# EAGLE schematic hackeeg-shield (EAGLE 9.5.2)

## Sheet 1 of 3: ADS1299 and power supplies
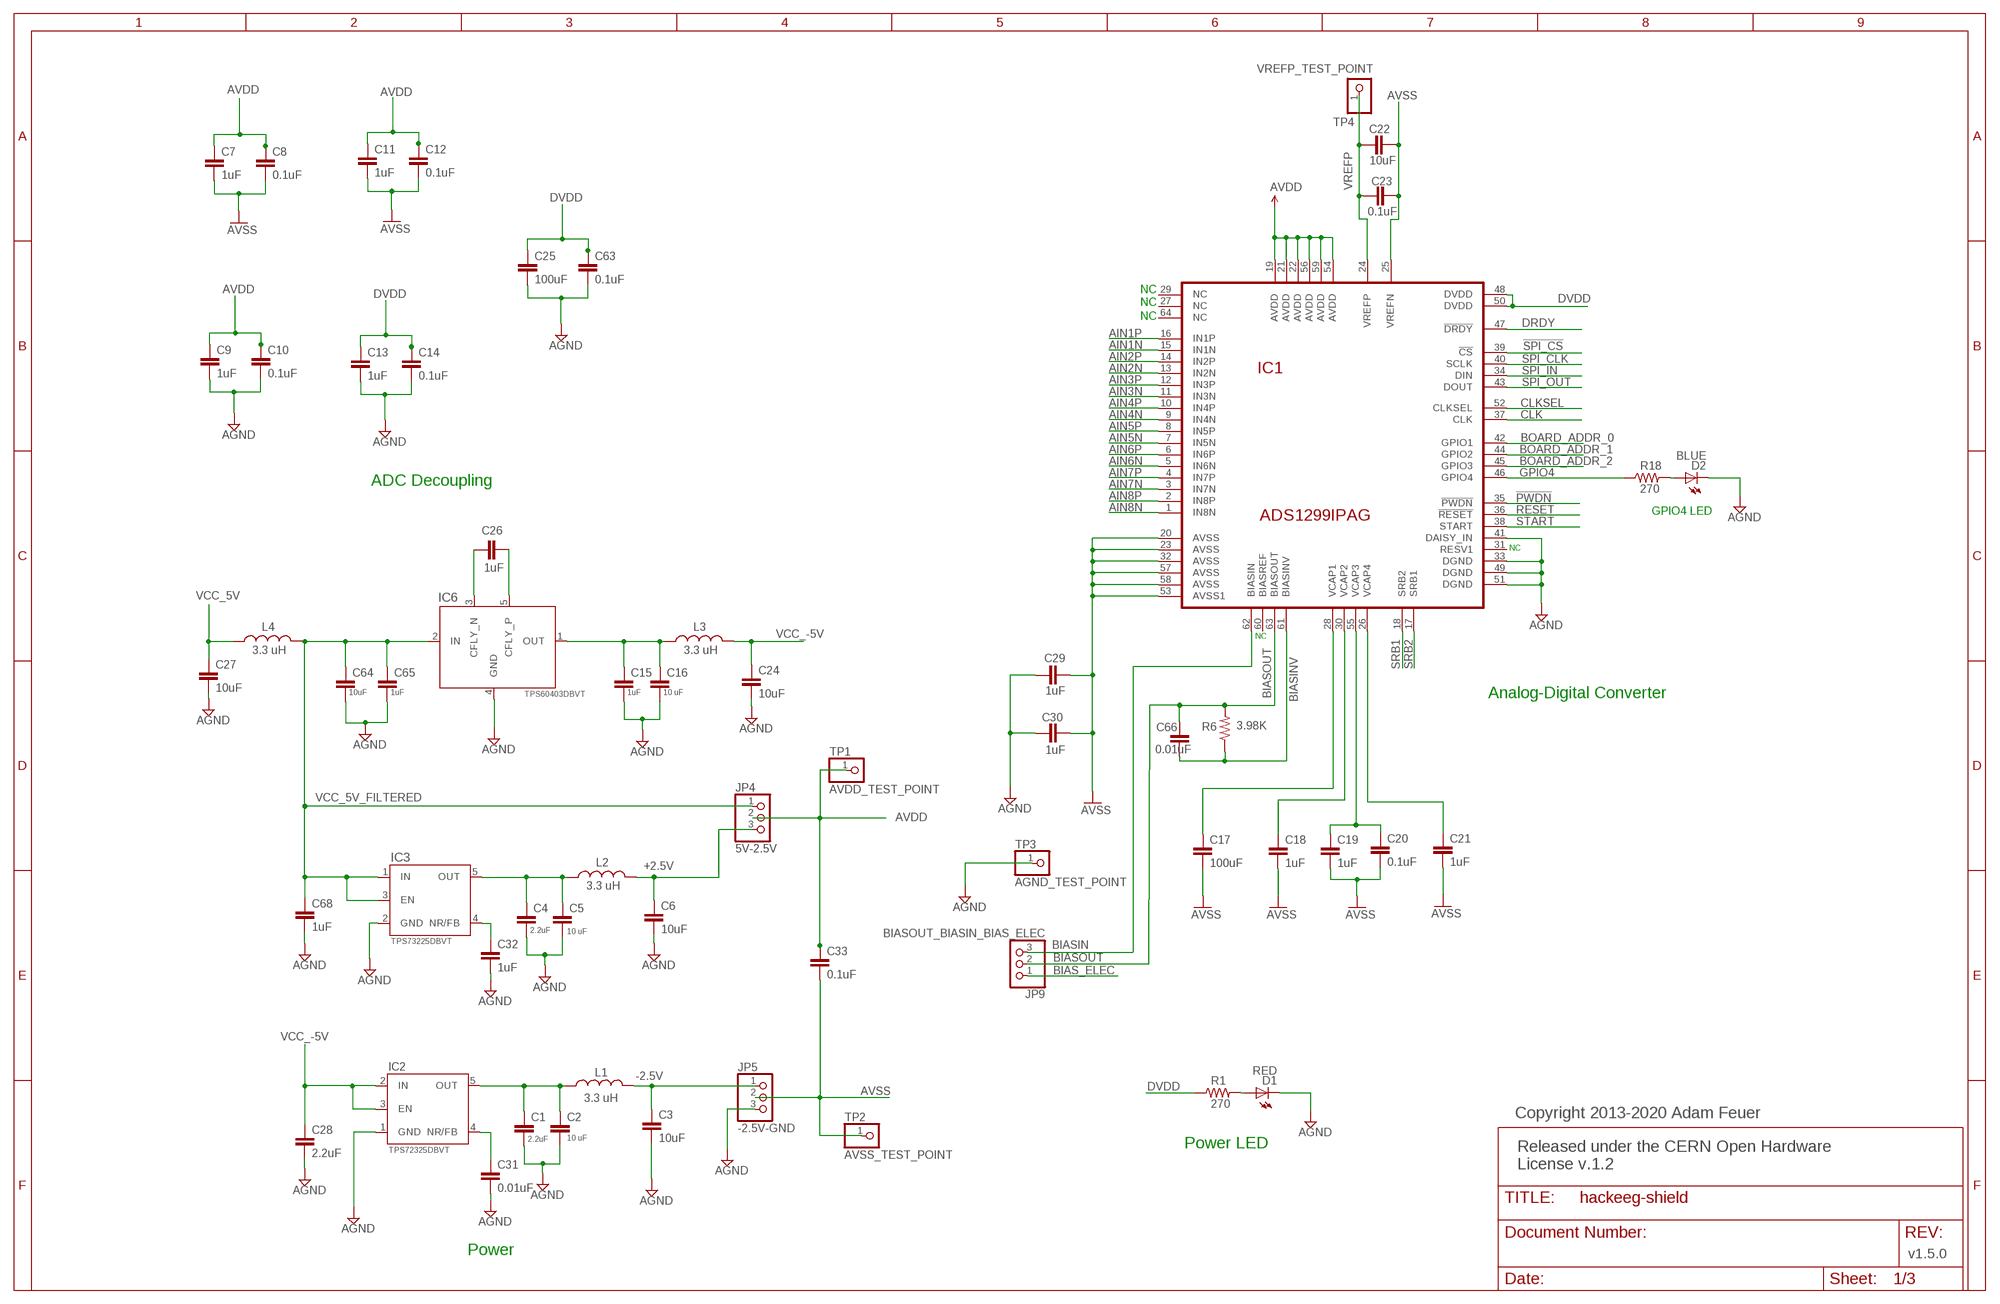
[diagram p0: schematic, sheet 1]

### Parts
C1  2.2uF  CAP0603-CAP  [0603-CAP]
C2  10 uF  CAP0603-CAP  [0603-CAP]
C3  10uF  CAP0603-CAP  [0603-CAP]
C4  2.2uF  CAP0603-CAP  [0603-CAP]
C5  10 uF  CAP0603-CAP  [0603-CAP]
C6  10uF  CAP0603-CAP  [0603-CAP]
C7  1uF  CAP0603-CAP  [0603-CAP]
C8  0.1uF  CAP0603-CAP  [0603-CAP]
C9  1uF  CAP0603-CAP  [0603-CAP]
C10  0.1uF  CAP0603-CAP  [0603-CAP]
C11  1uF  CAP0603-CAP  [0603-CAP]
C12  0.1uF  CAP0603-CAP  [0603-CAP]
C13  1uF  CAP0603-CAP  [0603-CAP]
C14  0.1uF  CAP0603-CAP  [0603-CAP]
C15  1uF  CAP0603-CAP  [0603-CAP]
C16  10 uF  CAP0603-CAP  [0603-CAP]
C17  100uF  CAP1210  [1210]
C18  1uF  CAP0603-CAP  [0603-CAP]
C19  1uF  CAP0603-CAP  [0603-CAP]
C20  0.1uF  CAP0603-CAP  [0603-CAP]
C21  1uF  CAP0603-CAP  [0603-CAP]
C22  10uF  CAP0603-CAP  [0603-CAP]
C23  0.1uF  CAP0603-CAP  [0603-CAP]
C24  10uF  CAP0603-CAP  [0603-CAP]
C25  100uF  CAP1210  [1210]
C26  1uF  CAP0603-CAP  [0603-CAP]
C27  10uF  CAP0603-CAP  [0603-CAP]
C28  2.2uF  CAP0603-CAP  [0603-CAP]
C29  1uF  CAP0603-CAP  [0603-CAP]
C30  1uF  CAP0603-CAP  [0603-CAP]
C31  0.01uF  CAP0603-CAP  [0603-CAP]
C32  1uF  CAP0603-CAP  [0603-CAP]
C33  0.1uF  CAP0603-CAP  [0603-CAP]
C63  0.1uF  CAP0603-CAP  [0603-CAP]
C64  10uF  CAP0603-CAP  [0603-CAP]
C65  1uF  CAP0603-CAP  [0603-CAP]
C66  0.01uF  CAP0603-CAP  [0603-CAP]
C68  1uF  CAP0603-CAP  [0603-CAP]
D1  RED  LED-RED1206  [LED-1206]
D2  BLUE  LED-WHITE  [LED-1206]
IC1  ADS1299IPAG  ADS1299*PAG*  [TQFP64]
IC2  TPS72325DBVT  TPS732XXDBV  [SOT23-5]
IC3  TPS73225DBVT  TPS732XXDBV  [SOT23-5]
IC6  TPS60403DBVT  TPS604XXDBV  [SOT23-5]
JP4  5V-2.5V  PINHD-1X3  [1X03]
JP5  -2.5V-GND  PINHD-1X3  [1X03]
JP9  BIASOUT_BIASIN_BIAS_ELEC  PINHD-1X3  [1X03]
L1  3.3 uH  INDUCTOR0805  [0805]
L2  3.3 uH  INDUCTOR0805  [0805]
L3  3.3 uH  INDUCTOR0805  [0805]
L4  3.3 uH  INDUCTOR0805  [0805]
R1  270  RESISTOR0603-RES  [0603-RES]
R6  3.98K  RESISTOR0603-RES  [0603-RES]
R18  270  RESISTOR0603-RES  [0603-RES]
TP1  AVDD_TEST_POINT  PINHD-1X1  [1X01]
TP2  AVSS_TEST_POINT  PINHD-1X1  [1X01]
TP3  AGND_TEST_POINT  PINHD-1X1  [1X01]
TP4  VREFP_TEST_POINT  PINHD-1X1  [1X01]

### Nets
!PWDN: IC1.35(!PWDN) ; also sheet 3
!RESET: IC1.36(!RESET) ; also sheet 3
!SPI_CS: IC1.39(!CS) ; also sheet 3
+2.5V: C6.1 JP4.3 L2.2
-2.5V: C3.1 JP5.1 L1.2
AGND: C1.2 C2.2 C3.2 C4.2 C5.2 C6.2 C9.2 C10.2 C13.2 C14.2 C15.2 C16.2 C24.2 C25.2 C27.2 C28.2 C29.1 C30.1 C31.2 C32.2 C63.2 C64.2 C65.2 C68.2 D1.C D2.C IC1.33(DGND) IC1.41(DAISY_IN) IC1.49(DGND) IC1.51(DGND) IC2.1(GND) IC3.2(GND) IC6.4(GND) JP5.3 TP3.1 ; also sheet 2,3
AIN1N: IC1.15(IN1N) ; also sheet 2
AIN1P: IC1.16(IN1P) ; also sheet 2
AIN2N: IC1.13(IN2N) ; also sheet 2
AIN2P: IC1.14(IN2P) ; also sheet 2
AIN3N: IC1.11(IN3N) ; also sheet 2
AIN3P: IC1.12(IN3P) ; also sheet 2
AIN4N: IC1.9(IN4N) ; also sheet 2
AIN4P: IC1.10(IN4P) ; also sheet 2
AIN5N: IC1.7(IN5N) ; also sheet 2
AIN5P: IC1.8(IN5P) ; also sheet 2
AIN6N: IC1.5(IN6N) ; also sheet 2
AIN6P: IC1.6(IN6P) ; also sheet 2
AIN7N: IC1.3(IN7N) ; also sheet 2
AIN7P: IC1.4(IN7P) ; also sheet 2
AIN8N: IC1.1(IN8N) ; also sheet 2
AIN8P: IC1.2(IN8P) ; also sheet 2
AVDD: C7.1 C8.1 C9.1 C10.1 C11.1 C12.1 C33.1 IC1.19(AVDD) IC1.21(AVDD) IC1.22(AVDD) IC1.54(AVDD) IC1.56(AVDD) IC1.59(AVDD) JP4.2 TP1.1 ; also sheet 2
AVSS: C7.2 C8.2 C11.2 C12.2 C17.2 C18.2 C19.2 C20.2 C21.2 C22.2 C23.2 C29.2 C30.2 C33.2 IC1.20(AVSS) IC1.23(AVSS) IC1.25(VREFN) IC1.32(AVSS) IC1.53(AVSS1) IC1.57(AVSS) IC1.58(AVSS) JP5.2 TP2.1 ; also sheet 2
BIAS_ELEC: JP9.1 ; also sheet 2
BIASIN: IC1.62(BIASIN) JP9.3
BIASINV: C66.2 IC1.61(BIASINV) R6.1 ; also sheet 2,3
BIASOUT: C66.1 IC1.63(BIASOUT) JP9.2 R6.2
BOARD_ADDR_0: IC1.42(GPIO1) ; also sheet 3
BOARD_ADDR_1: IC1.44(GPIO2) ; also sheet 3
BOARD_ADDR_2: IC1.45(GPIO3) ; also sheet 3
CLK: IC1.37(CLK) ; also sheet 3
CLKSEL: IC1.52(CLKSEL) ; also sheet 3
DRDY: IC1.47(!DRDY) ; also sheet 3
DVDD: C13.1 C14.1 C25.1 C63.1 IC1.48(DVDD) IC1.50(DVDD) R1.1 ; also sheet 2,3
GPIO4: IC1.46(GPIO4) R18.1
N$1: C4.1 C5.1 IC3.5(OUT) L2.1
N$2: C1.1 C2.1 IC2.5(OUT) L1.1
N$3: C17.1 IC1.28(VCAP1)
N$4: C18.1 IC1.30(VCAP2)
N$5: C19.1 C20.1 IC1.55(VCAP3)
N$7: C15.1 C16.1 IC6.1(OUT) L3.1
N$8: C21.1 IC1.26(VCAP4)
N$9: C26.2 IC6.5(CFLY_P)
N$10: C26.1 IC6.3(CFLY_N)
N$11: C32.1 IC3.4(NR/FB)
N$13: C31.1 IC2.4(NR/FB)
N$14: D2.A R18.2
N$19: D1.A R1.2
SPI_CLK: IC1.40(SCLK) ; also sheet 3
SPI_IN: IC1.34(DIN) ; also sheet 3
SPI_OUT: IC1.43(DOUT) ; also sheet 3
SRB1: IC1.18(SRB2) ; also sheet 2
SRB2: IC1.17(SRB1) ; also sheet 2
START: IC1.38(START) ; also sheet 3
VCC_5V: C27.1 L4.1 ; also sheet 3
VCC_5V_FILTERED: C64.1 C65.1 C68.1 IC3.1(IN) IC3.3(EN) IC6.2(IN) JP4.1 L4.2
VCC_-5V: C24.1 C28.1 IC2.2(IN) IC2.3(EN) L3.2
VREFP: C22.1 C23.1 IC1.24(VREFP) TP4.1
Unconnected: IC1.27(NC) IC1.29(NC) IC1.31(RESV1) IC1.60(BIASREF) IC1.64(NC)

### Notes on the sheet
- NC
- NC
- NC
- ADC Decoupling
- GPIO4 LED
- NC
- NC
- Analog-Digital Converter
- Copyright 2013-2020 Adam Feuer
- Power LED
- Released under the CERN Open Hardware 
  License v.1.2
- Power | v1.5.0

## Sheet 2 of 3: Input filtering and electrode connector
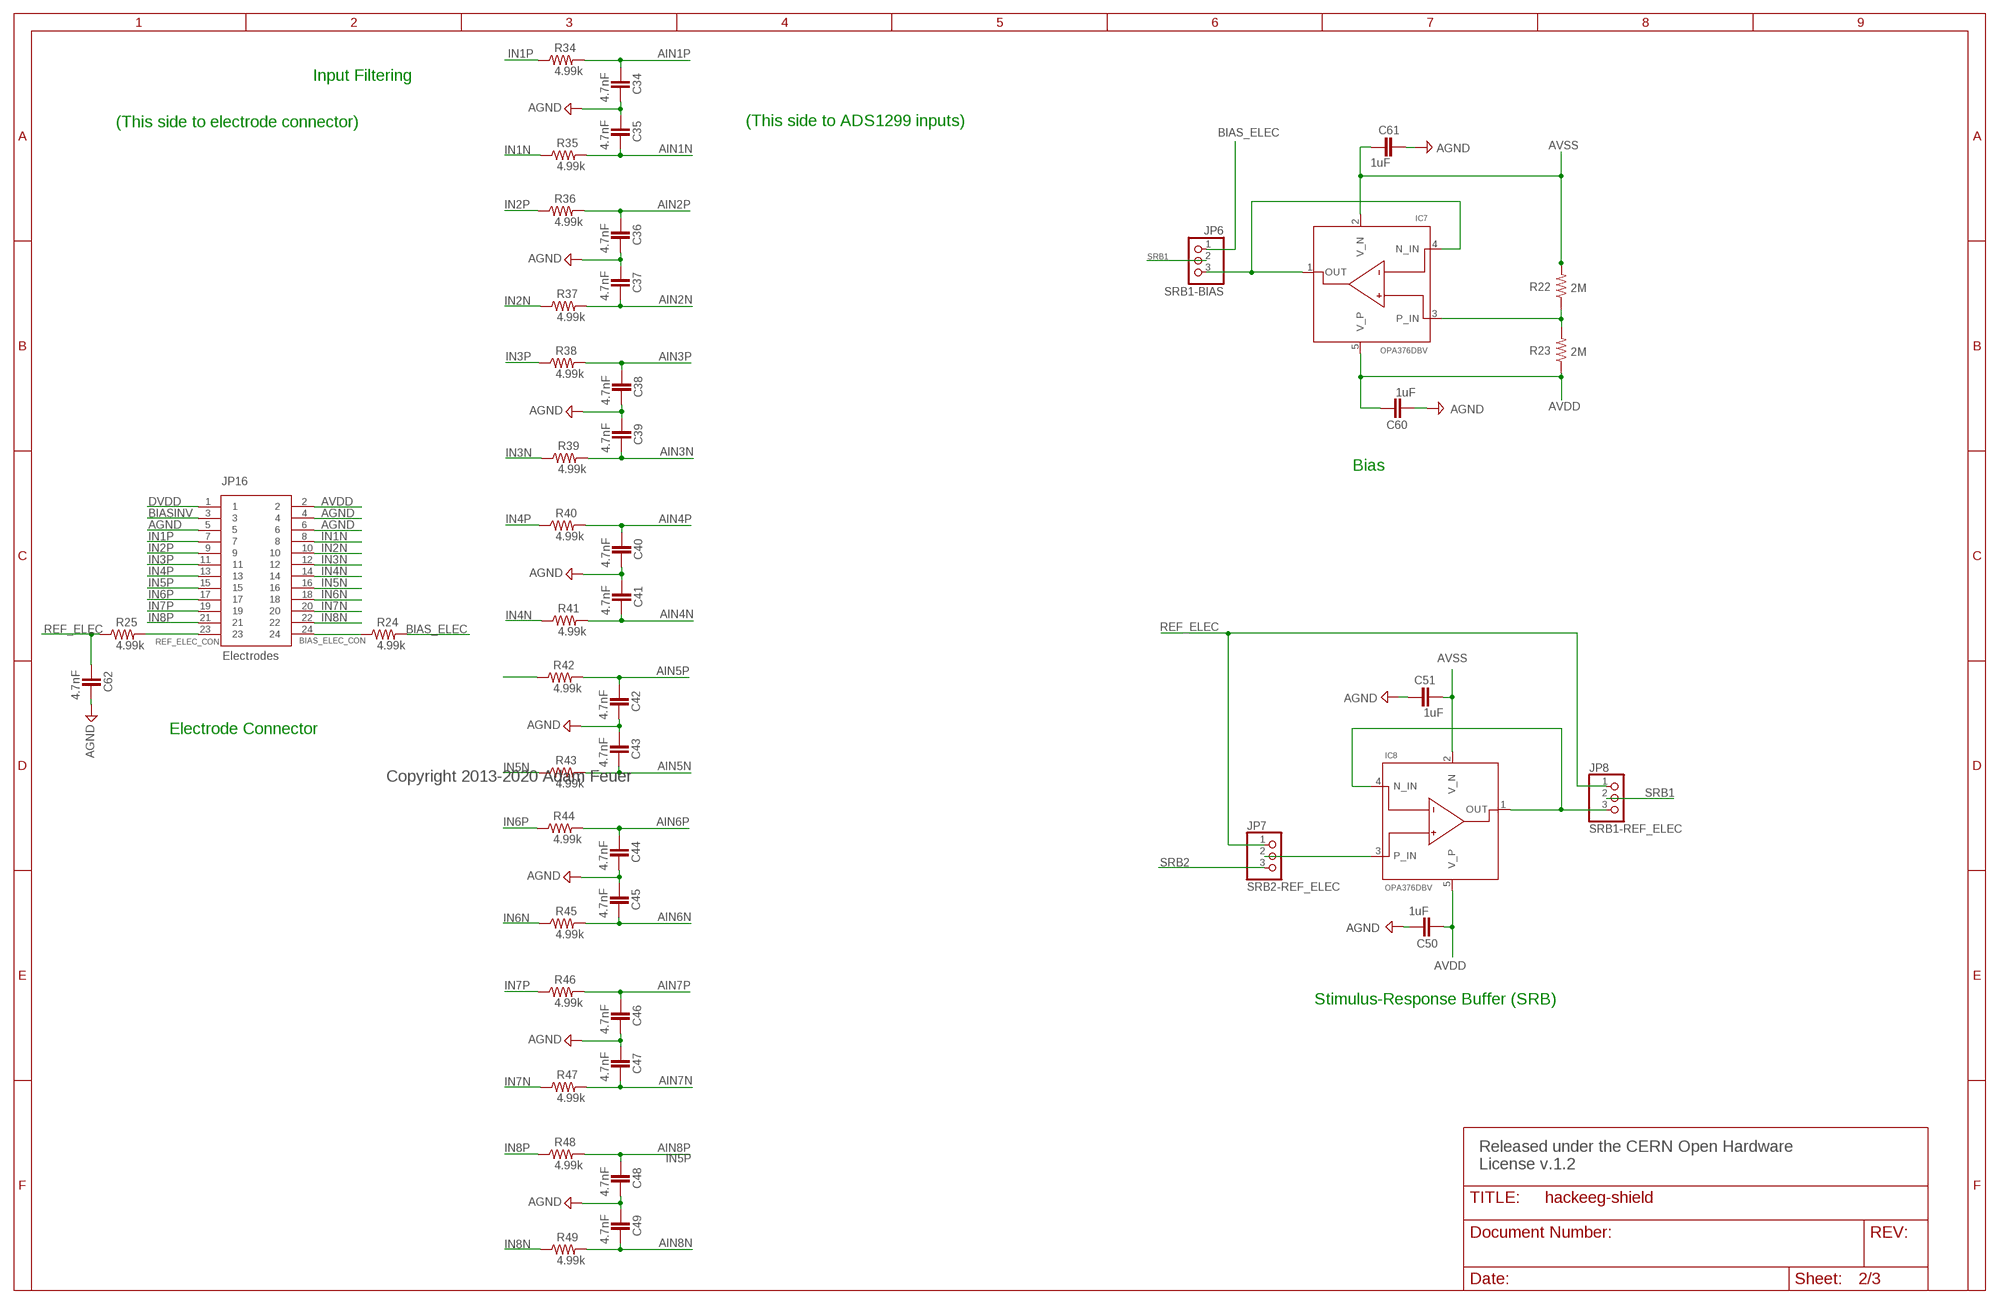
[diagram p1: schematic, sheet 2]

### Parts
C34  4.7nF  CAP0603-CAP  [0603-CAP]
C35  4.7nF  CAP0603-CAP  [0603-CAP]
C36  4.7nF  CAP0603-CAP  [0603-CAP]
C37  4.7nF  CAP0603-CAP  [0603-CAP]
C38  4.7nF  CAP0603-CAP  [0603-CAP]
C39  4.7nF  CAP0603-CAP  [0603-CAP]
C40  4.7nF  CAP0603-CAP  [0603-CAP]
C41  4.7nF  CAP0603-CAP  [0603-CAP]
C42  4.7nF  CAP0603-CAP  [0603-CAP]
C43  4.7nF  CAP0603-CAP  [0603-CAP]
C44  4.7nF  CAP0603-CAP  [0603-CAP]
C45  4.7nF  CAP0603-CAP  [0603-CAP]
C46  4.7nF  CAP0603-CAP  [0603-CAP]
C47  4.7nF  CAP0603-CAP  [0603-CAP]
C48  4.7nF  CAP0603-CAP  [0603-CAP]
C49  4.7nF  CAP0603-CAP  [0603-CAP]
C50  1uF  CAP0603-CAP  [0603-CAP]
C51  1uF  CAP0603-CAP  [0603-CAP]
C60  1uF  CAP0603-CAP  [0603-CAP]
C61  1uF  CAP0603-CAP  [0603-CAP]
C62  4.7nF  CAP0603-CAP  [0603-CAP]
IC7  OPA376DBV  [SOT23-5]
IC8  OPA376DBV  [SOT23-5]
JP6  SRB1-BIAS  PINHD-1X3  [1X03]
JP7  SRB2-REF_ELEC  PINHD-1X3  [1X03]
JP8  SRB1-REF_ELEC  PINHD-1X3  [1X03]
JP16  Electrodes  302-R241  [OST_302-R241]
R22  2M  RESISTOR0603-RES  [0603-RES]
R23  2M  RESISTOR0603-RES  [0603-RES]
R24  4.99k  RESISTOR0603-RES  [0603-RES]
R25  4.99k  RESISTOR0603-RES  [0603-RES]
R34  4.99k  RESISTOR0603-RES  [0603-RES]
R35  4.99k  RESISTOR0603-RES  [0603-RES]
R36  4.99k  RESISTOR0603-RES  [0603-RES]
R37  4.99k  RESISTOR0603-RES  [0603-RES]
R38  4.99k  RESISTOR0603-RES  [0603-RES]
R39  4.99k  RESISTOR0603-RES  [0603-RES]
R40  4.99k  RESISTOR0603-RES  [0603-RES]
R41  4.99k  RESISTOR0603-RES  [0603-RES]
R42  4.99k  RESISTOR0603-RES  [0603-RES]
R43  4.99k  RESISTOR0603-RES  [0603-RES]
R44  4.99k  RESISTOR0603-RES  [0603-RES]
R45  4.99k  RESISTOR0603-RES  [0603-RES]
R46  4.99k  RESISTOR0603-RES  [0603-RES]
R47  4.99k  RESISTOR0603-RES  [0603-RES]
R48  4.99k  RESISTOR0603-RES  [0603-RES]
R49  4.99k  RESISTOR0603-RES  [0603-RES]

### Nets
AGND: C34.2 C35.1 C36.2 C37.1 C38.2 C39.1 C40.2 C41.1 C42.2 C43.1 C44.2 C45.1 C46.2 C47.1 C48.2 C49.1 C50.2 C51.1 C60.2 C61.1 C62.2 JP16.4 JP16.5 JP16.6 ; also sheet 1,3
AIN1N: C35.2 R35.2 ; also sheet 1
AIN1P: C34.1 R34.2 ; also sheet 1
AIN2N: C37.2 R37.2 ; also sheet 1
AIN2P: C36.1 R36.2 ; also sheet 1
AIN3N: C39.2 R39.2 ; also sheet 1
AIN3P: C38.1 R38.2 ; also sheet 1
AIN4N: C41.2 R41.2 ; also sheet 1
AIN4P: C40.1 R40.2 ; also sheet 1
AIN5N: C43.2 R43.2 ; also sheet 1
AIN5P: C42.1 R42.2 ; also sheet 1
AIN6N: C45.2 R45.2 ; also sheet 1
AIN6P: C44.1 R44.2 ; also sheet 1
AIN7N: C47.2 R47.2 ; also sheet 1
AIN7P: C46.1 R46.2 ; also sheet 1
AIN8N: C49.2 R49.2 ; also sheet 1
AIN8P: C48.1 R48.2 ; also sheet 1
AVDD: C50.1 C60.1 IC7.5(V_P) IC8.5(V_P) JP16.2 R23.1 ; also sheet 1
AVSS: C51.2 C61.2 IC7.2(V_N) IC8.2(V_N) R22.2 ; also sheet 1
BIAS_ELEC: JP6.1 R24.2 ; also sheet 1
BIAS_ELEC_CON: JP16.24 R24.1
BIASINV: JP16.3 ; also sheet 1,3
DVDD: JP16.1 ; also sheet 1,3
IN1N: JP16.8 R35.1
IN1P: JP16.7 R34.1
IN2N: JP16.10 R37.1
IN2P: JP16.9 R36.1
IN3N: JP16.12 R39.1
IN3P: JP16.11 R38.1
IN4N: JP16.14 R41.1
IN4P: JP16.13 R40.1
IN5N: JP16.16 R43.1
IN5P: JP16.15 R42.1
IN6N: JP16.18 R45.1
IN6P: JP16.17 R44.1
IN7N: JP16.20 R47.1
IN7P: JP16.19 R46.1
IN8N: JP16.22 R49.1
IN8P: JP16.21 R48.1
N$15: IC7.3(P_IN) R22.1 R23.2
N$16: IC8.3(P_IN) JP7.2
N$17: IC8.1(OUT) IC8.4(N_IN) JP8.3
N$18: IC7.1(OUT) IC7.4(N_IN) JP6.3
REF_ELEC: C62.1 JP7.1 JP8.1 R25.1
REF_ELEC_CON: JP16.23 R25.2
SRB1: JP6.2 JP8.2 ; also sheet 1
SRB2: JP7.3 ; also sheet 1

### Notes on the sheet
- Input Filtering
- (This side to electrode connector) | (This side to ADS1299 inputs)
- Bias
- Electrode Connector
- Copyright 2013-2020 Adam Feuer
- Stimulus-Response Buffer (SRB)
- Released under the CERN Open Hardware 
  License v.1.2

## Sheet 3 of 3: Board to board connectors, configuration, EEPROM, and level shifting
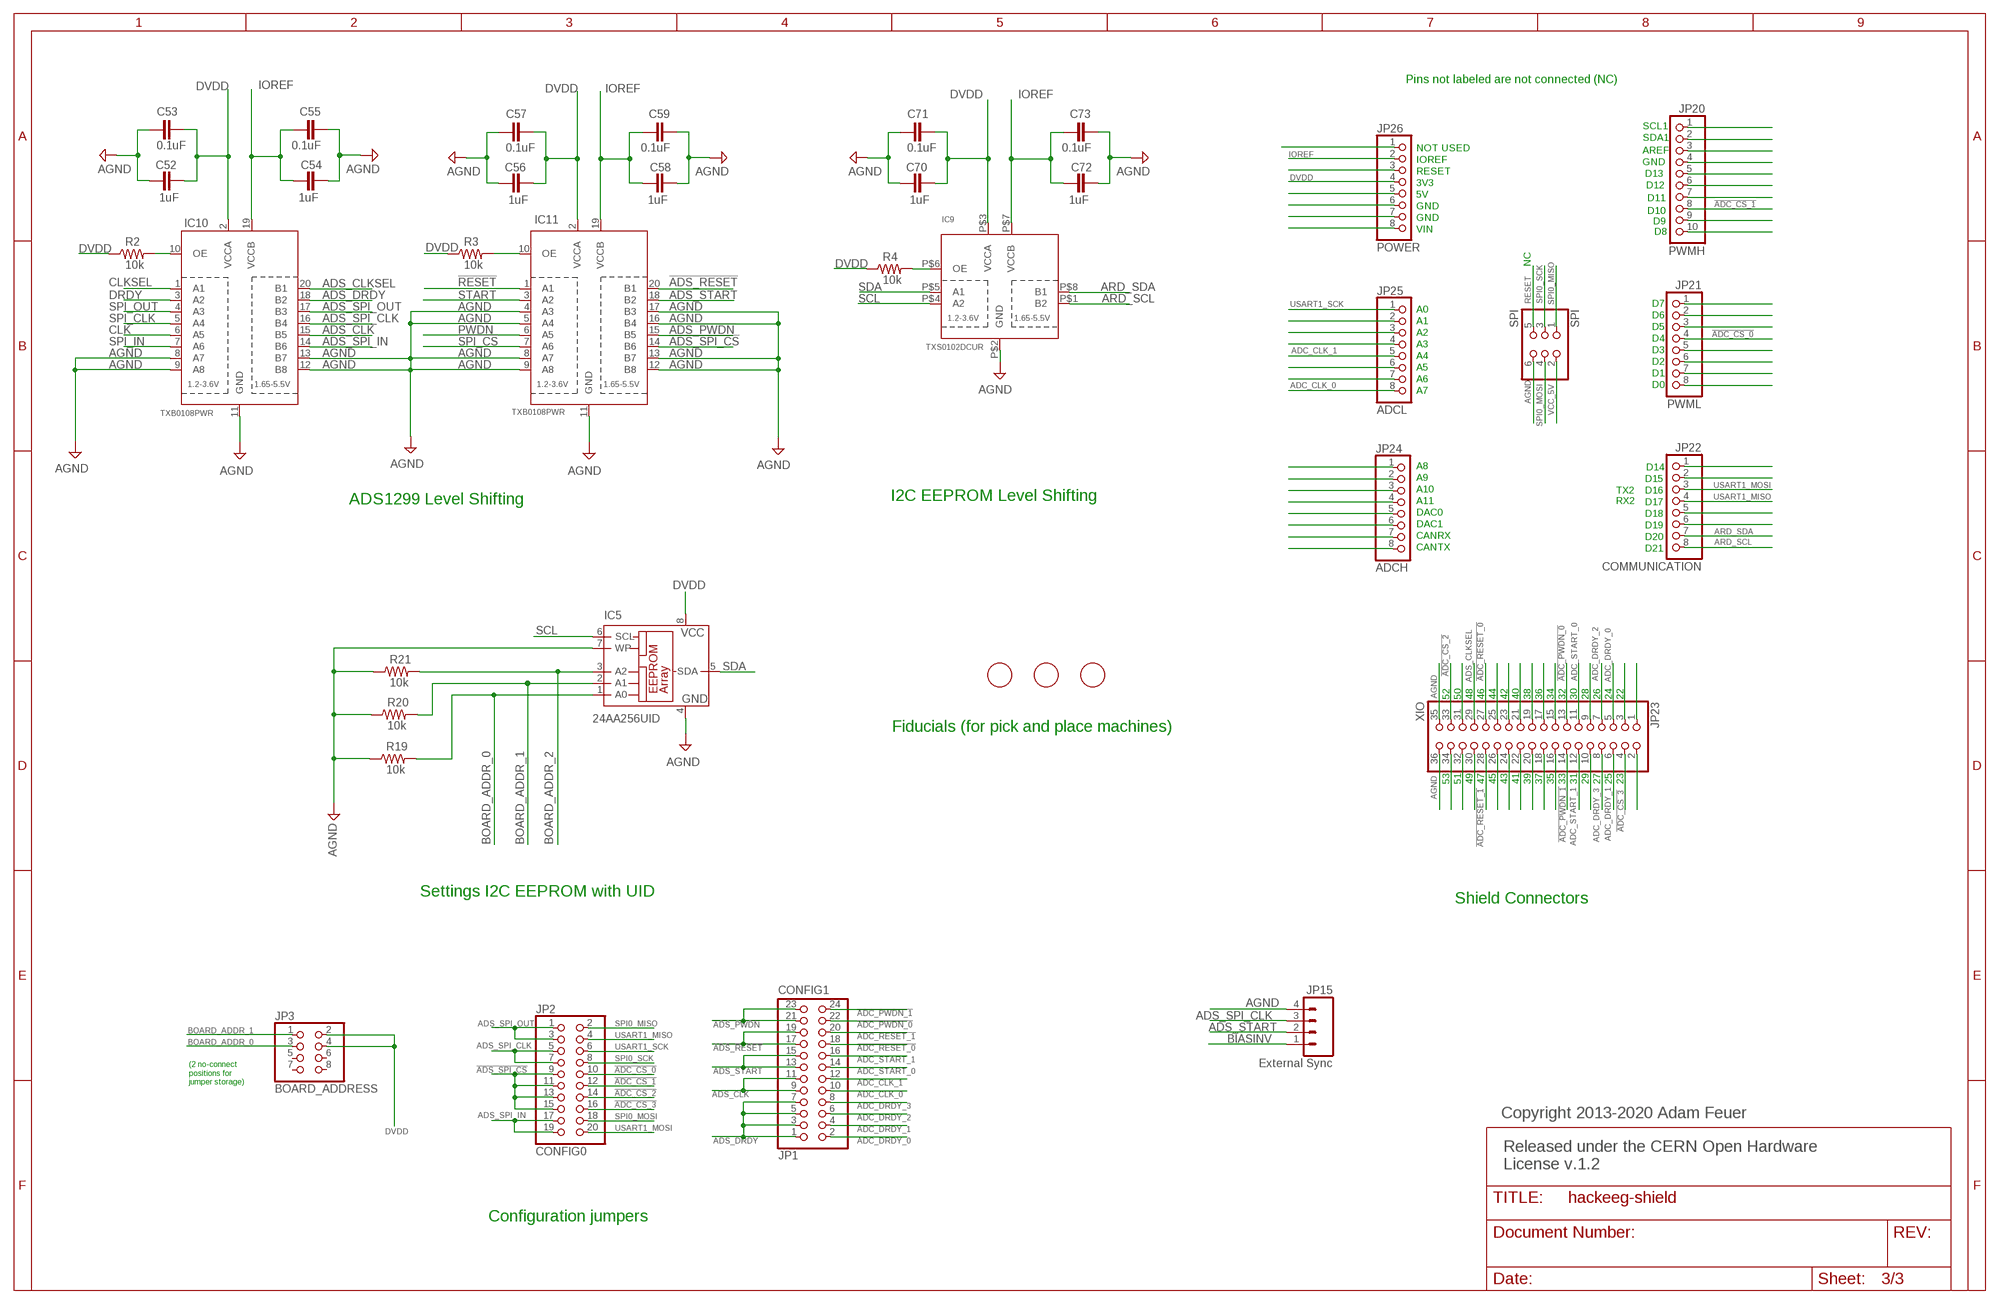
[diagram p2: schematic, sheet 3]

### Parts
C52  1uF  CAP0603-CAP  [0603-CAP]
C53  0.1uF  CAP0603-CAP  [0603-CAP]
C54  1uF  CAP0603-CAP  [0603-CAP]
C55  0.1uF  CAP0603-CAP  [0603-CAP]
C56  1uF  CAP0603-CAP  [0603-CAP]
C57  0.1uF  CAP0603-CAP  [0603-CAP]
C58  1uF  CAP0603-CAP  [0603-CAP]
C59  0.1uF  CAP0603-CAP  [0603-CAP]
C70  1uF  CAP0603-CAP  [0603-CAP]
C71  0.1uF  CAP0603-CAP  [0603-CAP]
C72  1uF  CAP0603-CAP  [0603-CAP]
C73  0.1uF  CAP0603-CAP  [0603-CAP]
IC5  24AA256UID  24LC256SN  [SO-08]
IC9  TXS0102DCUR  TXS0102  [VFSOP-8]
IC10  TXB0108PWR  [TSSOP20]
IC11  TXB0108PWR  [TSSOP20]
JP1  CONFIG1  PINHD-2X12  [2X12]
JP2  CONFIG0  PINHD-2X10  [2X10]
JP3  BOARD_ADDRESS  PINHD-2X4  [2X04]
JP15  External Sync  M04JST-PTH  [JST-4-PTH]
JP20  PWMH  PINHD-1X10  [1X10]
JP21  PWML  PINHD-1X8  [1X08]
JP22  COMMUNICATION  PINHD-1X8  [1X08]
JP23  XIO  PINHD-2X18  [2X18]
JP24  ADCH  PINHD-1X8  [1X08]
JP25  ADCL  PINHD-1X8  [1X08]
JP26  POWER  PINHD-1X8  [1X08]
R2  10k  RESISTOR0603-RES  [0603-RES]
R3  10k  RESISTOR0603-RES  [0603-RES]
R4  10k  RESISTOR0603-RES  [0603-RES]
R19  10k  RESISTOR0603-RES  [0603-RES]
R20  10k  RESISTOR0603-RES  [0603-RES]
R21  10k  RESISTOR0603-RES  [0603-RES]
SPI  SPI  PINHD-2X3  [2X03]
U$2  FIDUCIAL  [FIDUCIAL_1MM]
U$5  FIDUCIAL  [FIDUCIAL_1MM]
U$6  FIDUCIAL  [FIDUCIAL_1MM]

### Nets
!ADC_CS_0: JP2.10 JP21.4
!ADC_CS_1: JP2.12 JP20.8
!ADC_CS_2: JP2.14 JP23.33
!ADC_CS_3: JP2.16 JP23.4
!ADC_PWDN_0: JP1.22 JP23.13
!ADC_PWDN_1: JP1.24 JP23.14
!ADC_RESET_0: JP1.18 JP23.27
!ADC_RESET_1: JP1.20 JP23.28
!ADS_PWDN: IC11.15(B5) JP1.21 JP1.23
!ADS_RESET: IC11.20(B1) JP1.17 JP1.19
!ADS_SPI_CS: IC11.14(B6) JP2.9 JP2.11 JP2.13 JP2.15
!PWDN: IC11.6(A5) ; also sheet 1
!RESET: IC11.1(A1) ; also sheet 1
!SPI_CS: IC11.7(A6) ; also sheet 1
ADC_CLK_0: JP1.10 JP25.8
ADC_CLK_1: JP1.12 JP25.5
ADC_DRDY_0: JP1.2 JP23.5
ADC_DRDY_1: JP1.4 JP23.6
ADC_DRDY_2: JP1.6 JP23.7
ADC_DRDY_3: JP1.8 JP23.8
ADC_START_0: JP1.14 JP23.11
ADC_START_1: JP1.16 JP23.12
ADS_CLK: IC10.15(B5) JP1.9 JP1.11
ADS_CLKSEL: IC10.20(B1) JP23.29
ADS_DRDY: IC10.18(B2) JP1.1 JP1.3 JP1.5 JP1.7
ADS_SPI_CLK: IC10.16(B4) JP2.5 JP2.7 JP15.3
ADS_SPI_IN: IC10.14(B6) JP2.17 JP2.19
ADS_SPI_OUT: IC10.17(B3) JP2.1 JP2.3
ADS_START: IC11.18(B2) JP1.13 JP1.15 JP15.2
AGND: C52.1 C53.1 C54.1 C55.1 C56.1 C57.1 C58.1 C59.1 C70.1 C71.1 C72.1 C73.1 IC5.4(GND) IC5.7(WP) IC9.P$2(GND) IC10.8(A7) IC10.9(A8) IC10.11(GND) IC10.12(B8) IC10.13(B7) IC11.4(A3) IC11.5(A4) IC11.8(A7) IC11.9(A8) IC11.11(GND) IC11.12(B8) IC11.13(B7) IC11.16(B4) IC11.17(B3) JP15.4 JP23.35 JP23.36 R19.1 R20.1 R21.1 SPI.6 ; also sheet 1,2
ARD_SCL: IC9.P$1(B2) JP22.8
ARD_SDA: IC9.P$8(B1) JP22.7
BIASINV: JP15.1 ; also sheet 1,2
BOARD_ADDR_0: IC5.1(A0) JP3.3 R19.2 ; also sheet 1
BOARD_ADDR_1: IC5.2(A1) JP3.1 R20.2 ; also sheet 1
BOARD_ADDR_2: IC5.3(A2) R21.2 ; also sheet 1
CLK: IC10.6(A5) ; also sheet 1
CLKSEL: IC10.1(A1) ; also sheet 1
DRDY: IC10.3(A2) ; also sheet 1
DVDD: C52.2 C53.2 C56.2 C57.2 C70.2 C71.2 IC5.8(VCC) IC9.P$3(VCCA) IC10.2(VCCA) IC11.2(VCCA) JP3.2 JP3.4 JP26.4 R2.1 R3.1 R4.1 ; also sheet 1,2
IOREF: C54.2 C55.2 C58.2 C59.2 C72.2 C73.2 IC9.P$7(VCCB) IC10.19(VCCB) IC11.19(VCCB) JP26.2
N$6: JP20.9
N$20: JP24.1
N$21: JP26.1
N$24: JP21.7
N$27: JP20.3
N$28: JP20.4
N$29: JP20.5
N$30: JP20.6
N$31: JP20.7
N$33: JP20.10
N$34: JP21.1
N$35: JP21.2
N$36: JP21.3
N$37: IC9.P$6(OE) R4.2
N$38: JP21.5
N$39: JP21.6
N$40: JP21.8
N$41: JP22.1
N$42: JP22.2
N$45: JP22.5
N$46: JP22.6
N$48: JP24.8
N$49: JP24.7
N$50: JP24.6
N$51: JP24.5
N$52: JP24.4
N$53: JP24.3
N$54: JP24.2
N$59: JP25.4
N$60: JP25.3
N$61: JP25.2
N$62: JP26.8
N$63: JP26.7
N$64: JP26.6
N$67: JP26.3
N$78: JP23.34
N$79: JP23.32
N$80: JP23.30
N$82: JP23.26
N$83: JP23.24
N$84: JP23.22
N$85: JP23.20
N$86: JP23.18
N$87: JP23.16
N$90: JP23.10
N$95: JP23.3
N$98: JP23.9
N$101: JP23.15
N$102: JP23.17
N$103: JP23.19
N$104: JP23.21
N$107: JP23.23
N$108: JP23.25
N$111: JP23.31
N$501: JP25.7
N$510: JP25.6
N$561: IC10.10(OE) R2.2
N$562: IC11.10(OE) R3.2
N$570: JP26.5
N$571: JP23.1
N$572: JP23.2
N$6001: JP20.2
N$6002: JP20.1
RESET: SPI.5
SCL: IC5.6(SCL) IC9.P$4(A2)
SDA: IC5.5(SDA) IC9.P$5(A1)
SPI0_MISO: JP2.2 SPI.1
SPI0_MOSI: JP2.18 SPI.4
SPI0_SCK: JP2.8 SPI.3
SPI_CLK: IC10.5(A4) ; also sheet 1
SPI_IN: IC10.7(A6) ; also sheet 1
SPI_OUT: IC10.4(A3) ; also sheet 1
START: IC11.3(A2) ; also sheet 1
USART1_MISO: JP2.4 JP22.4
USART1_MOSI: JP2.20 JP22.3
USART1_SCK: JP2.6 JP25.1
VCC_5V: SPI.2 ; also sheet 1
Unconnected: JP3.5 JP3.6 JP3.7 JP3.8

### Notes on the sheet
- Pins not labeled are not connected (NC)
- SCL1
- SDA1
- NOT USED | AREF
- IOREF | GND
- RESET | D13
- 3V3 | D12
- 5V
- D11
- GND
- D10
- GND
- D9
- VIN | D8
- NC
- D7
- A0
- D6
- A1
- D5
- A2
- D4
- A3
- D3
- A4
- D2
- A5
- D1
- A6
- D0
- A7
- A8 | D14
- A9 | D15
- A10 | TX2 | D16
- ADS1299 Level Shifting | I2C EEPROM Level Shifting
- A11 | RX2 | D17
- DAC0 | D18
- DAC1 | D19
- CANRX | D20
- CANTX | D21
- 52 | 50 | 48 | 46 | 44 | 42 | 40 | 38 | 36 | 34 | 32 | 30 | 28 | 26 | 24 | 22
- Fiducials (for pick and place machines)
- 53 | 51 | 49 | 47 | 45 | 43 | 41 | 39 | 37 | 35 | 33 | 31 | 29 | 27 | 25 | 23
- Settings I2C EEPROM with UID
- Shield Connectors
- (2 no-connect
  positions for
  jumper storage)
- Copyright 2013-2020 Adam Feuer
- Released under the CERN Open Hardware 
  License v.1.2
- Configuration jumpers

## Library data of the parts
C1-C66 C68 C70-C73 = SparkFun-Passives:CAP: Capacitor Standard 0603 ceramic capacitor, and 0.1" leaded capacitor.
D1 = SparkFun-LED:LED-RED: Assorted Red LEDs LilyPad 1206- DIO-09912 1206- DIO-00809 0603- DIO-00819; PROD_ID: DIO-00809
D2 = SparkFun-LED:LED-WHITE: White SMD LEDs LilyPad 1206- DIO-09955; PROD_ID: DIO-09955; VALUE: WHITE
IC1 = ADS129x:ADS1299: 8-Channel, 24-Bit Analog-To-Digital Converter With Integrated EEG Front End. ADS1299 modifications by Adam Feuer (adam@adamfeuer.com) Based on ADS1298: Drawn 23.07.2011 by Tomasz Boleslaw CEDRO (http://www.tomek.cedro.info).
IC2 = TPS723xx:TPS732XX: Cap-Free, NMOS, 250mA Low Dropout Regulator with Reverse Current Protection
IC3 = TPS32xx:TPS732XX: Cap-Free, NMOS, 250mA Low Dropout Regulator with Reverse Current Protection
IC5 = microchip:24*: Serial EEPROM I2C; MF: MICROCHIP; MPN: 24LC256-I/SN; OC_FARNELL: 9757996; OC_NEWARK: 27C9144
IC6 = TPS604xx:TPS604XX: 60mA Charge Pump Voltage Inverter with Fixed 250kHz Operation
IC7 IC8 = OPA376:OPA376: Low-Noise, Low Quiescent Current, Precision Operational Amplifier
IC9 = adafruit:TXS0102: 2-Bit Bi-Directional Level Shifter (I2C, etc.) Designed for I2C devices and has internal pullups. Not to be confused with TXB010x series. 1.2V-3.6V (VCCA) to 1.65V-5.5V (VCCB) bi-directional level shifter with auto direction sensing. Max data rate - 24Mbps (Push Pull), 2Mbps (Open Drain) Digikey: 296-21931-1-ND
IC10 IC11 = adafruit:TXB0108PWR: 8-Bit Bi-Directional Level Shifter 1.2V-3.6V (VCCA) to 1.65V-5.5V (VCCB) bi-directional level shifter with auto direction sensing. Max data rate - VCCA 1.8V: 20Mbps (50ns), VCCA 3.3V: 100Mbps (10ns) Digikey: 296-21527-1-ND
JP1 = headers:PINHD-2X12: PIN HEADER
JP2 = headers:PINHD-2X10: PIN HEADER
JP3 = headers:PINHD-2X4: PIN HEADER
JP4 JP5 JP9 = headers:PINHD-1X3: PIN HEADER
JP6-JP8 = adafruit:PINHD-1X3: PIN HEADER
JP15 = SparkFun-Connectors:M04: Header 4 Standard 4-pin 0.1" header. Use with straight break away headers (SKU : PRT-00116), right angle break away headers (PRT-00553), swiss pins (PRT-00743), machine pins (PRT-00117), and female headers (PRT-00115). Molex polarized connector foot print use with SKU : PRT-08231 with associated crimp pins and housings. 1MM SMD Version SKU: PRT-10208; SKU: PRT-09916
JP16 = OS302-R241:302-R241: Conn Socket Strip SKT 24 POS 2.54mm Solder RA Thru-Hole; AVAILABILITY: Unavailable; DESCRIPTION: Conn Socket Strip SKT 24 POS 2.54mm Solder RA Thru-Hole; MF: On Shore; MP: 302-R241; PACKAGE: None; PRICE: None
JP20 = SmartPrj:PINHD-1X10: PIN HEADER
JP21 JP22 JP24-JP26 = SmartPrj:PINHD-1X8: PIN HEADER
JP23 = SmartPrj:PINHD-2X18: PIN HEADER
L1-L4 = SparkFun-Passives:INDUCTOR: Inductors Basic Inductor/Choke - 0603 and 1206. Footprints are not proven and vary greatly between part numbers. SRN6045- 33uH, 20% 1.4A
R1-R4 R6 R18-R25 R34-R49 = SparkFun-Passives:RESISTOR: Resistor Basic schematic elements and footprints for 0603, 1206, and PTH resistors.
SPI = SmartPrj:PINHD-2X3: PIN HEADER
TP1-TP4 = adafruit:PINHD-1X1: Pin header 1x1 for 0.1" spacing With round pins
U$2 U$5 U$6 = adafruit:FIDUCIAL: For use by pick and place machines to calibrate the vision/machine, 1mm By microbuilder.eu